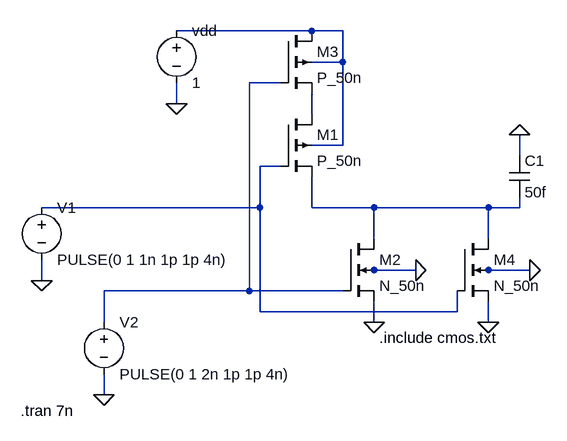
[diagram p0: schematic nor.asc]
nor.asc, the LTspice schematic file:
Version 4
SHEET 1 880 680
WIRE 256 -96 48 -96
WIRE 304 -96 256 -96
WIRE 304 -48 304 -96
WIRE 304 -48 256 -48
WIRE 208 -16 160 -16
WIRE 48 16 48 -16
WIRE 256 32 256 0
WIRE 304 80 304 -48
WIRE 304 80 256 80
WIRE 576 96 576 64
WIRE 208 112 176 112
WIRE 176 176 176 112
WIRE 176 176 -160 176
WIRE 256 176 256 128
WIRE 352 176 256 176
WIRE 528 176 352 176
WIRE 576 176 576 160
WIRE 576 176 528 176
WIRE 352 224 352 176
WIRE 528 224 528 176
WIRE 352 272 336 272
WIRE 416 272 352 272
WIRE 528 272 512 272
WIRE 592 272 528 272
WIRE -160 288 -160 256
WIRE 160 304 160 -16
WIRE 160 304 -64 304
WIRE 304 304 160 304
WIRE 176 336 176 176
WIRE 480 336 480 304
WIRE 480 336 176 336
WIRE -64 352 -64 304
WIRE 352 352 352 320
WIRE 528 352 528 320
WIRE -64 464 -64 432
FLAG 48 16 0
FLAG -160 288 0
FLAG -64 464 0
FLAG 352 352 0
FLAG 416 272 0
FLAG 528 352 0
FLAG 592 272 0
FLAG 576 64 0
SYMBOL voltage 48 -112 R0
WINDOW 123 0 0 Left 0
WINDOW 39 0 0 Left 0
SYMATTR InstName vdd
SYMATTR Value 1
SYMBOL voltage -160 160 R0
SYMATTR InstName V1
SYMATTR Value PULSE(0 1 1n 1p 1p 4n)
SYMBOL voltage -64 336 R0
SYMATTR InstName V2
SYMATTR Value PULSE(0 1 2n 1p 1p 4n)
SYMBOL nmos4 304 224 R0
SYMATTR InstName M2
SYMATTR Value N_50n
SYMATTR Value2 l=50n w=500n
SYMBOL pmos4 208 -96 R0
SYMATTR InstName M3
SYMATTR Value P_50n
SYMATTR Value2 l=50n w=1u
SYMBOL nmos4 480 224 R0
SYMATTR InstName M4
SYMATTR Value N_50n
SYMATTR Value2 l=50n w=500n
SYMBOL pmos4 208 32 R0
SYMATTR InstName M1
SYMATTR Value P_50n
SYMATTR Value2 l=50n w=1u
SYMBOL cap 560 96 R0
SYMATTR InstName C1
SYMATTR Value 50f
TEXT 360 376 Left 2 !.include cmos.txt
TEXT -192 488 Left 2 !.tran 7n

The netlist it stands for:
* nor.asc
vdd N001 0 1
V1 N004 0 PULSE(0 1 1n 1p 1p 4n)
V2 N002 0 PULSE(0 1 2n 1p 1p 4n)
M2 N005 N002 0 0 N_50n l=50n w=500n
M3 N001 N002 N003 N001 P_50n l=50n w=1u
M4 N005 N004 0 0 N_50n l=50n w=500n
M1 N003 N004 N005 N001 P_50n l=50n w=1u
C1 0 N005 50f
.model NMOS NMOS
.model PMOS PMOS
.lib standard.mos
.include cmos.txt
.tran 7n
.backanno
.end